# EAGLE design Maple5 (EAGLE 9.1.0)
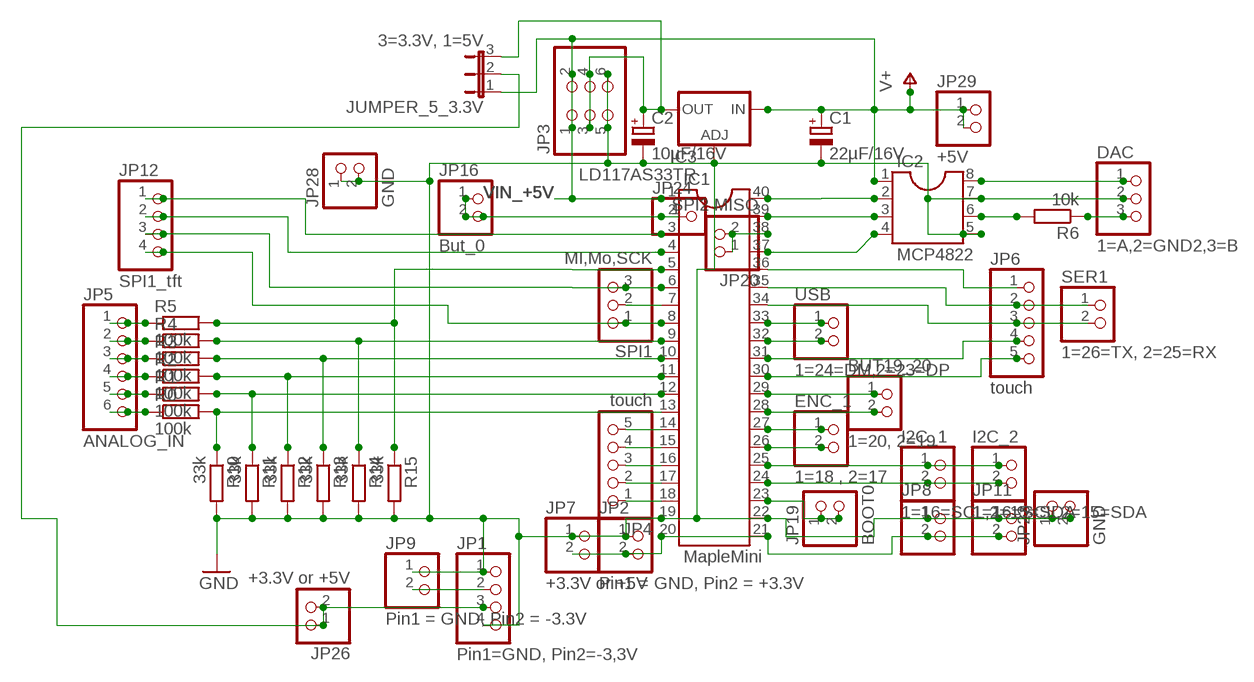
[diagram p0: schematic, sheet 1]

## Parts
BUT19_20  1=20, 2=19  PINHD-1X2  [1X02]
C1  22µF/16V  CPOL-EUE5-8.5  [E5-8,5]
C2  10µF/16V  CPOL-EUE5-8.5  [E5-8,5]
DAC  1=A,2=GND2,3=B  PINHD-1X3  [1X03]
ENC_1  1=18 , 2=17  PINHD-1X2  [1X02]
I2C_1  1=16=SCL,2=15=SDA  PINHD-1X2  [1X02]
I2C_2  1=16=SCL,2=15=SDA  PINHD-1X2  [1X02]
IC1  MapleMini  DIL40  [DIL40]
IC2  MCP4822  DIL8S  [SOCKET-08]
IC3  LD117AS33TR  [SOT223]
JP1  Pin1=GND, Pin2=-3,3V  PINHD-1X4  [1X04]
JP2  Pin1 = GND, Pin2 = +3.3V  PINHD-1X2  [1X02]
JP3  PINHD-2X3  [2X03]
JP4  touch  PINHD-1X5  [1X05]
JP5  ANALOG_IN  PINHD-1X6  [1X06]
JP6  touch  PINHD-1X5  [1X05]
JP7  +3.3V or +5V  PINHD-1X2  [1X02]
JP8  PINHD-1X2  [1X02]
JP9  Pin1 = GND, Pin2 = -3.3V  PINHD-1X2  [1X02]
JP11  PINHD-1X2  [1X02]
JP12  SPI1_tft  PINHD-1X4  [1X04]
JP16  But_0  PINHD-1X2  [1X02]
JP19  BOOT0  PINHD-1X2  [1X02]
JP20  SPI2 MISO  PINHD-1X2  [1X02]
JP23  GND  PINHD-1X2  [1X02]
JP24  PINHD-1X1  [1X01]
JP26  +3.3V or +5V  PINHD-1X2  [1X02]
JP28  GND  PINHD-1X2  [1X02]
JP29  +5V  PINHD-1X2  [1X02]
JUMPER_5_3.3V  3=3.3V, 1=5V  JP2E  [JP2]
R0  100k  R-EU_0207/7  [0207/7]
R1  100k  R-EU_0207/7  [0207/7]
R2  100k  R-EU_0207/7  [0207/7]
R3  100k  R-EU_0207/7  [0207/7]
R4  100k  R-EU_0207/7  [0207/7]
R5  100k  R-EU_0207/7  [0207/7]
R6  10k  R-EU_0207/7  [0207/7]
R10  33k  R-EU_0207/7  [0207/7]
R11  33k  R-EU_0207/7  [0207/7]
R12  33k  R-EU_0207/7  [0207/7]
R13  33k  R-EU_0207/7  [0207/7]
R14  33k  R-EU_0207/7  [0207/7]
R15  33k  R-EU_0207/7  [0207/7]
SER1  1=26=TX, 2=25=RX  PINHD-1X2  [1X02]
SPI1  MI,Mo,SCK  PINHD-1X3  [1X03]
USB  1=24=DM,2=23=DP  PINHD-1X2  [1X02]

## Nets
1_PB10: IC1.3 JP12.1
2_PB2: IC1.4 JP12.2
3_PB0: IC1.5 R5.2 R15.1
4_PA7: IC1.6 JP12.3 SPI1.3
6_PA5: IC1.8 JP12.4 SPI1.1
7_PA4: IC1.10 R3.2 R13.1
8_PA3: IC1.11 R2.2 R12.1
10_PA1: IC1.12 R1.2 R11.1
11_PA0: IC1.13 R0.2 R10.1
GND: C1.- C2.- DAC.2 IC1.19 IC1.22 IC2.5 IC2.7 IC3.1(ADJ) JP1.1 JP1.4 JP2.1 JP3.5 JP3.6 JP7.1 JP8.1 JP9.1 JP11.1 JP23.1 JP23.2 JP28.1 JP28.2 R10.2 R11.2 R12.2 R13.2 R14.2 R15.2
N$1: IC1.9 R4.2 R14.1
N$2: JP5.1 R5.1
N$3: JP5.2 R4.1
N$4: JP5.4 R2.1
N$5: JP5.5 R1.1
N$6: JP5.6 R0.1
N$7: JP5.3 R3.1
N$8: IC1.30 JP6.5
N$9: IC1.7 SPI1.2
N$10: IC1.32 USB.2
N$11: IC1.2 JP16.1 JP16.2 JP24.1
N$12: IC1.31 JP6.4
N$13: JP1.2 JP9.2
N$14: ENC_1.1 IC1.27
N$15: JP1.3 JP26.1 JP26.2 JUMPER_5_3.3V.2
N$16: IC1.38 JP20.1 JP20.2
N$17: IC1.33 USB.1
N$18: IC1.36 JP6.1
N$19: IC1.35 JP6.2 SER1.1
N$20: IC2.6 R6.2
N$21: IC1.40 IC2.2
N$22: IC1.39 IC2.3
N$23: IC1.14 JP4.5
N$24: IC1.37 IC2.4
N$25: IC1.15 JP4.4
N$26: C2.+ IC3.4(OUT) JP3.3 JP3.4 JUMPER_5_3.3V.3
N$27: IC1.34 JP6.3 SER1.2
N$28: IC1.16 JP4.3
N$29: IC1.17 JP4.2
N$30: IC1.18 JP4.1
N$32: BUT19_20.1 IC1.29
N$33: BUT19_20.2 IC1.28
N$35: ENC_1.2 IC1.26
N$36: I2C_1.1 I2C_2.1 IC1.25
N$37: I2C_1.2 I2C_2.2 IC1.24
N$38: IC1.23 JP19.1 JP19.2
N$39: IC1.20 IC1.21 JP2.2 JP7.2 JP8.2 JP11.2
N$44: DAC.3 R6.1
N$45: DAC.1 IC2.8
VIN_+5V: C1.+ IC1.1 IC2.1 IC3.3(IN) JP3.1 JP3.2 JP29.1 JP29.2 JUMPER_5_3.3V.1 ; supply symbol labelled V+

## Library data of the parts
BUT19_20 ENC_1 I2C_1 I2C_2 JP2 JP7-JP9 JP11 JP16 JP19 JP20 JP23 JP26 JP28 JP29 SER1 USB = pinhead:PINHD-1X2: PIN HEADER
C1 C2 = rcl:CPOL-EU: POLARIZED CAPACITOR, European symbol; SPICEPREFIX: C
DAC SPI1 = pinhead:PINHD-1X3: PIN HEADER
IC1 = ic-package:DIL40: Dual In Line
IC2 = ic-package:DIL8: Dual In Line / Socket
IC3 = v-reg:LD117A?*: Low drop fixed and adjustable positive voltage regulators 1 A Source: http://www.st.com/stonline/products/literature/ds/7194/ld1117axx.pdf
JP1 JP12 = pinhead:PINHD-1X4: PIN HEADER
JP3 = pinhead:PINHD-2X3: PIN HEADER
JP4 JP6 = pinhead:PINHD-1X5: PIN HEADER
JP5 = pinhead:PINHD-1X6: PIN HEADER
JP24 = pinhead:PINHD-1X1: PIN HEADER
JUMPER_5_3.3V = jumper:JP2E: JUMPER
R0 R1-R6 R10-R15 = resistor:R-EU_: RESISTOR, European symbol

## Board
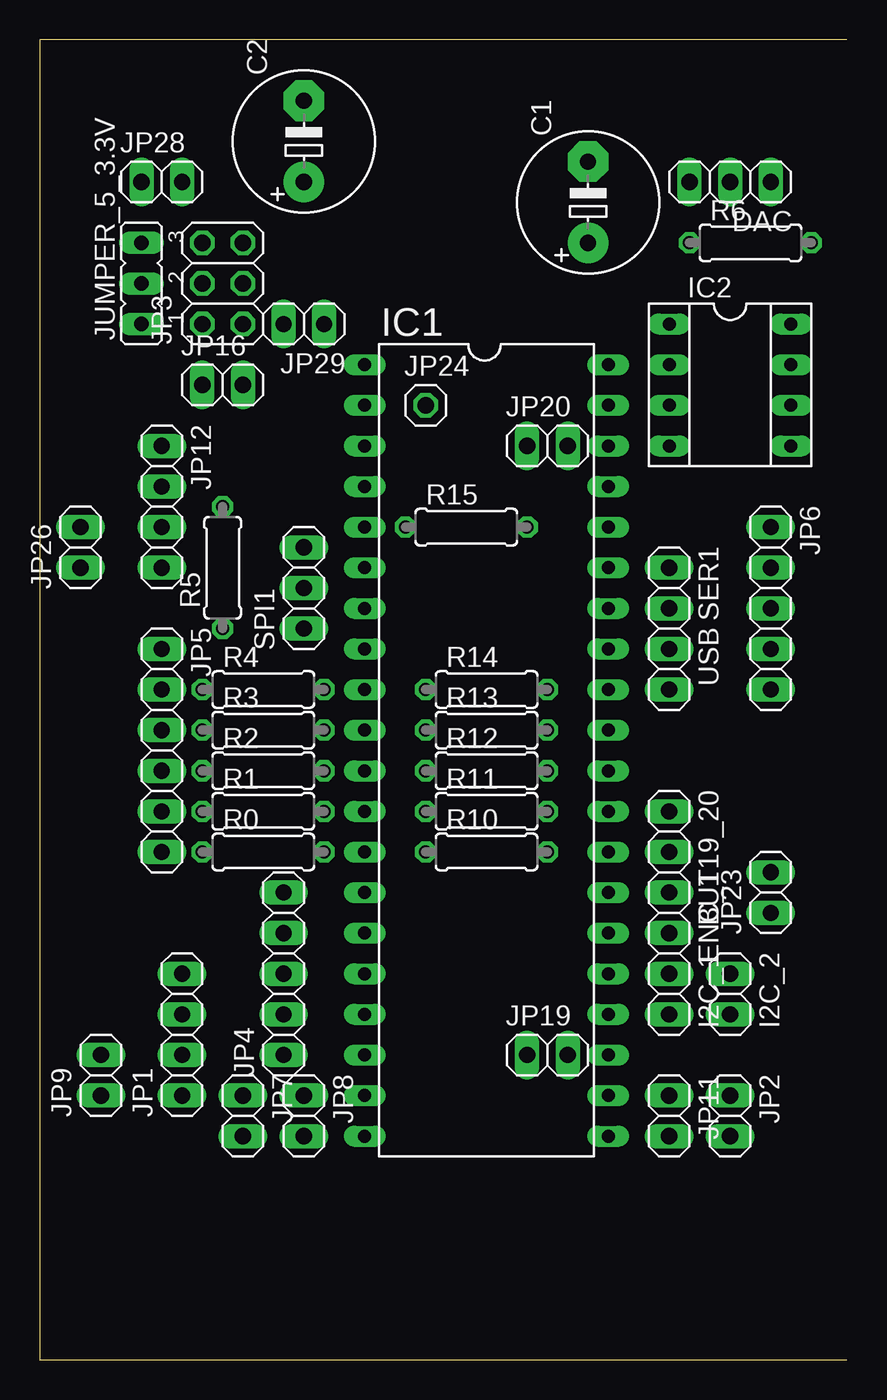
[diagram p1: board, top side]
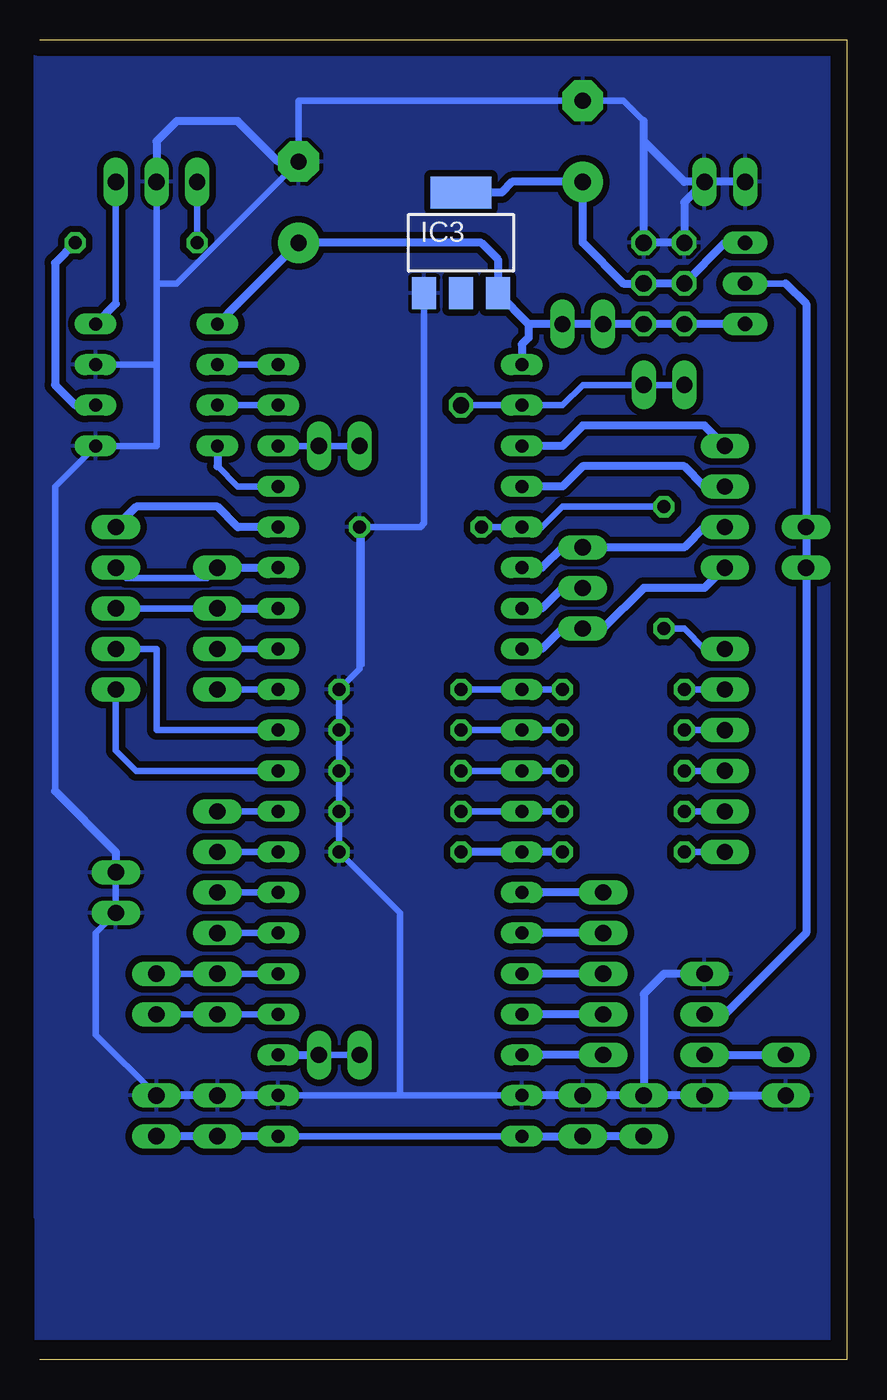
[diagram p2: board, bottom side, seen from below]

Size 50.47 x 82.54 mm. Coordinates in mm from the lower left corner, seen from the top.
Outline: 50.47,0 0,0 0,82.54 50.47,82.54
Copper layers (1*16): Top 0.035mm / dielectric 1.5mm / Bottom 0.035mm
Design rules "default": minimum track width 6mil, minimum drill 0.35mm, track to track 6mil, track to pad 6mil, pad to pad 6mil, via to via 6mil, smd to smd 6mil, copper to edge 40mil, drill to drill 6mil, minimum pad ring 10mil, minimum via ring 8mil, stop-mask expansion 4mil, vias tented up to drill 0mil, thermal gap 10mil

### Footprints (pad centres in the part's own frame; a part is rotated, then mirrored left to right if it is on the bottom)
1X02 = drill 1.016 long: 1 -1.27,0; 2 1.27,0
E5-8,5 = drill 1.016 pad 2.54: + -2.54,0 | drill 1.016 pad 2.54 octagon: - 2.54,0
1X03 = drill 1.016 long: 1 -2.54,0; 2 0,0; 3 2.54,0
DIL40 = drill 0.813 long: 1 -24.13,-7.62; 2 -21.59,-7.62; 3 -19.05,-7.62; 4 -16.51,-7.62; 5 -13.97,-7.62; 6 -11.43,-7.62; 7 -8.89,-7.62; 8 -6.35,-7.62; 9 -3.81,-7.62; 10 -1.27,-7.62; 11 1.27,-7.62; 12 3.81,-7.62; 13 6.35,-7.62; 14 8.89,-7.62; 15 11.43,-7.62; 16 13.97,-7.62; 17 16.51,-7.62; 18 19.05,-7.62; 19 21.59,-7.62; 20 24.13,-7.62; 21 24.13,7.62; 22 21.59,7.62; 23 19.05,7.62; 24 16.51,7.62; 25 13.97,7.62; 26 11.43,7.62; 27 8.89,7.62; 28 6.35,7.62; 29 3.81,7.62; 30 1.27,7.62; 31 -1.27,7.62; 32 -3.81,7.62; 33 -6.35,7.62; 34 -8.89,7.62; 35 -11.43,7.62; 36 -13.97,7.62; 37 -16.51,7.62; 38 -19.05,7.62; 39 -21.59,7.62; 40 -24.13,7.62
SOCKET-08 = drill 0.813 long: 1 -3.81,-3.81; 2 -1.27,-3.81; 3 1.27,-3.81; 4 3.81,-3.81; 5 3.81,3.81; 6 1.27,3.81; 7 -1.27,3.81; 8 -3.81,3.81
SOT223 = smd 1.5 x 2: 1 -2.3,-3.15; 2 0,-3.15; 3 2.3,-3.15 | smd 3.8 x 2: 4 0,3.15
1X04 = drill 1.016 long: 1 -3.81,0; 2 -1.27,0; 3 1.27,0; 4 3.81,0
2X03 = drill 1.016 octagon: 1 -2.54,-1.27; 2 -2.54,1.27; 3 0,-1.27; 4 0,1.27; 5 2.54,-1.27; 6 2.54,1.27
1X05 = drill 1.016 long: 1 -5.08,0; 2 -2.54,0; 3 0,0; 4 2.54,0; 5 5.08,0
1X06 = drill 1.016 long: 1 -6.35,0; 2 -3.81,0; 3 -1.27,0; 4 1.27,0; 5 3.81,0; 6 6.35,0
1X01 = drill 1.016 octagon: 1 0,0
JP2 = drill 0.914 long: 1 -2.54,0; 2 0,0; 3 2.54,0
0207/7 = drill 0.813 octagon: 1 -3.81,0; 2 3.81,0

### Placement (x,y rotation side)
BUT19_20  39.37,33.02 270 top
C1  34.29,72.39 90 top
C2  16.51,76.2 90 top
DAC  43.18,73.66 180 top
ENC_1  39.37,27.94 270 top
I2C_1  39.37,22.86 270 top
I2C_2  43.18,22.86 270 top
IC1  27.94,38.1 270 top
IC2  43.18,60.96 270 top
IC3  24.13,69.85 0 bottom
JP1  8.89,20.32 90 top
JP2  43.18,15.24 270 top
JP3  11.43,67.31 90 top
JP4  15.24,24.13 90 top
JP5  7.62,38.1 270 top
JP6  45.72,46.99 270 top
JP7  12.7,15.24 270 top
JP8  16.51,15.24 270 top
JP9  3.81,17.78 90 top
JP11  39.37,15.24 270 top
JP12  7.62,53.34 270 top
JP16  11.43,60.96 0 top
JP19  31.75,19.05 0 top
JP20  31.75,57.15 0 top
JP23  45.72,29.21 90 top
JP24  24.13,59.69 0 top
JP26  2.54,50.8 90 top
JP28  7.62,73.66 0 top
JP29  16.51,64.77 180 top
JUMPER_5_3.3V  6.35,67.31 90 top
R0  13.97,31.75 0 top
R1  13.97,34.29 0 top
R2  13.97,36.83 0 top
R3  13.97,39.37 0 top
R4  13.97,41.91 0 top
R5  11.43,49.53 90 top
R6  44.45,69.85 0 top
R10  27.94,31.75 0 top
R11  27.94,34.29 0 top
R12  27.94,36.83 0 top
R13  27.94,39.37 0 top
R14  27.94,41.91 0 top
R15  26.67,52.07 0 top
SER1  39.37,48.26 270 top
SPI1  16.51,48.26 90 top
USB  39.37,43.18 270 top

### Tracks (layer width: path | path; a pad name or v marks a point on that pad's centre or on a via)
1_PB10
  Bottom 0.508: JP12.1 8.89,58.42 16.51,58.42 17.78,57.15 IC1.3
2_PB2
  Bottom 0.508: JP12.2 8.89,54.61 10.16,55.88 16.51,55.88 17.78,54.61 IC1.4
3_PB0
  Bottom 0.406: R5.2 17.78,53.34 19.05,52.07 IC1.5 R15.1
4_PA7
  Bottom 0.508: JP12.3 8.89,52.07 10.16,50.8 SPI1.3 17.78,50.8 19.05,49.53 IC1.6
6_PA5
  Bottom 0.508: JP12.4 8.89,48.26 12.7,48.26 15.24,45.72 SPI1.1 17.78,45.72 19.05,44.45 IC1.8
7_PA4
  Bottom 0.406: R13.1 IC1.10 R3.2
8_PA3
  Bottom 0.406: R12.1 IC1.11 R2.2
10_PA1
  Bottom 0.406: R11.1 IC1.12 R1.2
11_PA0
  Bottom 0.508: R0.2 IC1.13 R10.1
GND
  Bottom 0.152: R14.2 30.24,43.42 30.24,52.07 R15.2 | 43.18,62.23 43.18,67.31 DAC.2
  Bottom 0.406: 12.7,77.47 13.97,78.74 C2.- 34.29,78.74 C1.- 41.91,67.31 43.18,67.31 | IC3.1 26.43,52.31 26.67,52.07 30.24,52.07 | DAC.2 43.18,62.23 | IC2.7 43.18,62.23 | 49.53,35.56 49.53,54.61 IC2.5 43.18,57.15 43.18,62.23 | IC1.22 27.94,16.51 | 27.94,16.51 IC1.19 | R15.2 30.48,43.18 R14.2 R13.2 R12.2 R11.2 R10.2 27.94,27.94 27.94,16.51 | JP23.2 JP23.1 46.99,26.67 46.99,20.32 JP2.1
  Bottom 0.508: JP28.2 10.16,72.39 JP3.6 JP3.5 12.7,76.2 | JP28.1 JP28.2 | JP28.2 10.16,73.66 12.7,76.2 | 12.7,76.2 12.7,77.47 | JP7.1 12.7,22.86 11.43,24.13 JP1.4 | JP9.1 JP1.1 JP7.1 | JP23.2 45.72,31.75 49.53,35.56 | IC1.19 JP8.1 JP7.1 | IC1.22 JP11.1 JP2.1 | C1.- 35.56,74.93 38.1,77.47 41.91,77.47 43.18,76.2 DAC.2
  pour Bottom (isolate 0.406): 1.27,81.28 50.8,81.28 50.8,1.27 0,1.27 0,81.28
  pour Bottom (isolate 0.813): 1.27,82.55 50.8,82.55 50.8,8.89 0,8.89 0,82.55
N$1
  Bottom 0.406: R4.2 IC1.9 R14.1
N$2
  Bottom 0.406: R5.1 10.16,45.72 8.89,44.45 JP5.1
N$3
  Bottom 0.406: JP5.2 R4.1
N$4
  Bottom 0.406: JP5.4 R2.1
N$5
  Bottom 0.406: JP5.5 R1.1
N$6
  Bottom 0.406: JP5.6 R0.1
N$7
  Bottom 0.406: JP5.3 R3.1
N$8
  Bottom 0.406: IC1.30 44.45,36.83 45.72,38.1 JP6.5
N$9
  Bottom 0.508: SPI1.2 17.78,48.26 19.05,46.99 IC1.7
N$10
  Bottom 0.406: IC1.32 USB.2
N$11
  Bottom 0.406: JP16.1 JP16.2 16.51,60.96 17.78,59.69 IC1.2 JP24.1
N$12
  Bottom 0.406: IC1.31 43.18,39.37 43.18,44.45 JP6.4
N$13
  Bottom 0.508: JP1.2 JP9.2
N$14
  Bottom 0.406: IC1.27 ENC_1.1
N$15
  Bottom 0.406: JUMPER_5_3.3V.2 3.81,67.31
  Bottom 0.508: JP1.3 7.62,21.59 2.54,26.67 JP26.1 JP26.2 2.54,66.04 3.81,67.31
N$16
  Bottom 0.406: JP20.1 JP20.2 IC1.38
N$17
  Bottom 0.406: IC1.33 USB.1
N$18
  Bottom 0.508: IC1.36 38.1,52.07 39.37,53.34 44.45,53.34 JP6.1
N$19
  Bottom 0.152: JP6.2 45.09,48.89
  Bottom 0.406: SER1.1 40.01,48.89 45.09,48.89
  Bottom 0.508: SER1.1 IC1.35
N$20
  Bottom 0.508: R6.2 49.53,68.58 49.53,60.96 48.26,59.69 IC2.6
N$21
  Bottom 0.406: IC1.40 IC2.2
N$22
  Bottom 0.406: IC1.39 IC2.3
N$23
  Bottom 0.508: JP4.5 19.05,29.21 IC1.14
N$24
  Bottom 0.406: IC1.37 38.1,54.61 39.37,55.88
  Bottom 0.508: IC2.4 39.37,55.88
N$25
  Bottom 0.508: JP4.4 19.05,26.67 IC1.15
N$26
  Bottom 0.508: IC3.4 21.59,73 20.93,73.66 C2.+ 16.51,69.85 13.97,67.31 JP3.3 JP3.4 7.62,69.85 JUMPER_5_3.3V.3
N$27
  Bottom 0.406: SER1.2 JP6.3
  Bottom 0.508: SER1.2 IC1.34
N$28
  Bottom 0.508: JP4.3 19.05,24.13 IC1.16
N$29
  Bottom 0.508: IC1.17 19.05,21.59 JP4.2
N$30
  Bottom 0.508: JP4.1 19.05,19.05 IC1.18
N$32
  Bottom 0.406: IC1.29 BUT19_20.1
N$33
  Bottom 0.406: IC1.28 BUT19_20.2
N$35
  Bottom 0.406: IC1.26 ENC_1.2
N$36
  Bottom 0.406: IC1.25 I2C_1.1 I2C_2.1
N$37
  Bottom 0.406: IC1.24 I2C_1.2 I2C_2.2
N$38
  Bottom 0.406: JP19.1 JP19.2
  Bottom 0.508: IC1.23 JP19.2
N$39
  Bottom 0.406: IC1.20 IC1.21
  Bottom 0.508: IC1.20 JP8.2 JP7.2 | IC1.21 JP11.2 JP2.2
N$44
  Bottom 0.406: DAC.3 R6.1
N$45
  Bottom 0.406: DAC.1 45.72,66.04
  Bottom 0.508: 45.72,66.04 IC2.8
VIN_+5V
  Bottom 0.406: IC3.3 21.59,66.7 21.59,66.46
  Bottom 0.508: JUMPER_5_3.3V.1 JP3.2 JP3.1 JP29.2 JP29.1 19.9,64.77 | IC2.1 38.1,66.04 C1.+ 22.86,69.85 21.83,68.82 IC3.3 19.9,64.77 | 19.9,64.77 19.9,63.92 20.32,63.5 IC1.1